# Altium schematic sheet CAT-PTT.SchDoc: TS50S USB CAT
size A4; DocumentNumber: 2; Revision: 1; SheetNumber: 2; SheetTotal: 4
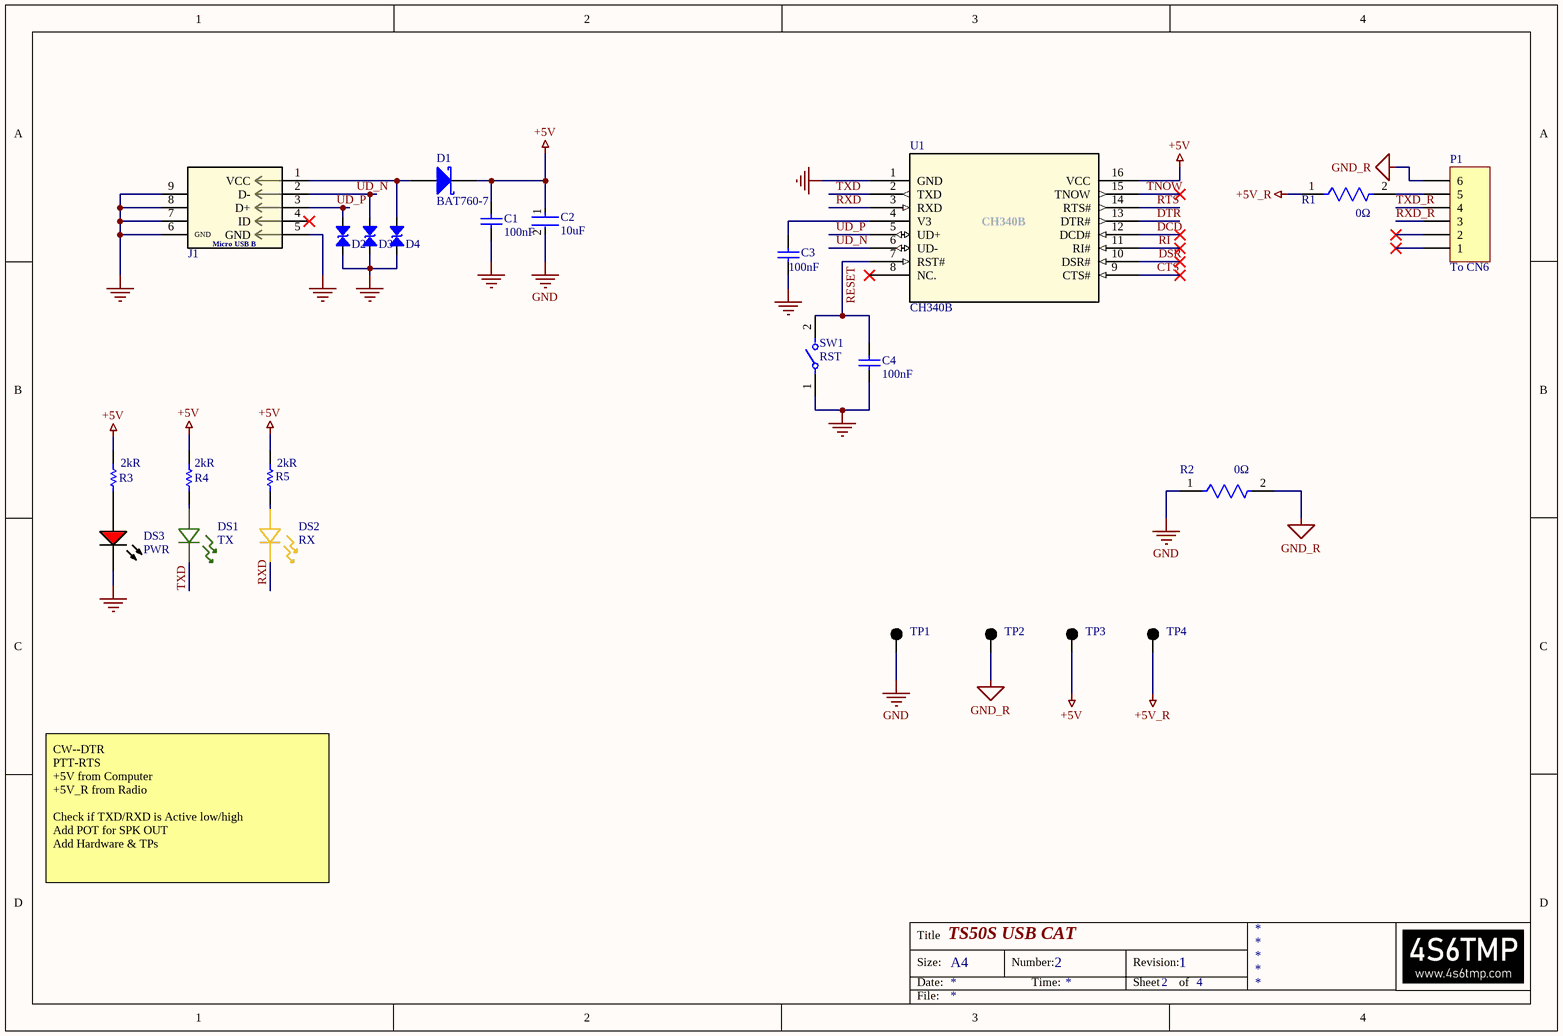
[diagram p0: CAT-PTT.SchDoc]

## Parts
C1  100nF  [CAPC1608X90X35ML10T15]
C2  10uF  [FP-GRM188-0_1-e0_2_0_55-IPC_A]
C3  100nF  [CAPC1608X90X35ML10T15]
C4  100nF  [CAPC1608X90X35ML10T15]
D1  BAT760-7  [SOD323_DIO]
D2  ESD Diode  [0603ESDA-05N]  (value not drawn)
D3  ESD Diode  [0603ESDA-05N]  (value not drawn)
D4  ESD Diode  [0603ESDA-05N]  (value not drawn)
DS1  TX  [LED_19-217/GHC-YR1S2/3T_EVE]
DS2  RX  [LED_19-217/GHC-YR1S2/3T_EVE]
DS3  PWR  [EVRL-0603-2_V]
J1  U254-051N-4BH806  [CONN_10103594-0001LF_AMP]  (value not drawn)
P1  To CN6  [HDR1X6]
R1  0Ω  [FP-RC0603-MFG]
R2  0Ω  [FP-RC0603-MFG]
R3  2kR  [RESC1608X55X25NL10T15]
R4  2kR  [RESC1608X55X25NL10T15]
R5  2kR  [RESC1608X55X25NL10T15]
SW1  RST  [FP-B3U-1000P-B-MFG]
TP1  GND  [KSTN-5001]  (value not drawn)
TP2  GND_R  [KSTN-5001]  (value not drawn)
TP3  +5V  [KSTN-5001]  (value not drawn)
TP4  +5V_R  [KSTN-5001]  (value not drawn)
U1  CH340B  [SOIC-16]

## Nets
+5V: C1.2 C2.1 D1.1(K) R3.2 R4.2 R5.2 TP3.1 U1.16(VCC)
+5V_R: R1.1 TP4.1
GND: C1.1 C2.2 C3.2 C4.1 D2.2 D3.2 D4.2 DS3.2(K) J1.5(GND) J1.6(GND) J1.7(GND) J1.8(GND) J1.9(GND) R2.1 SW1.1 TP1.1 U1.1(GND)
GND_R: P1.6 R2.2 TP2.1
CTS: U1.9(CTS#)
DCD: U1.12(DCD#)
DSR: U1.10(DSR#)
DTR: U1.13(DTR#)
RESET: C4.2 SW1.2 U1.7(RST#)
RI: U1.11(RI#)
RTS: U1.14(RTS#)
RXD: DS2.1 U1.3(RXD)
RXD_R: P1.3
TNOW: U1.15(TNOW)
TXD: DS1.1 U1.2(TXD)
TXD_R: P1.4
UD_N: D3.1 J1.2(D-) U1.6(UD-)
UD_P: D2.1 J1.3(D+) U1.5(UD+)
NetC3_1: C3.1 U1.4(V3)
NetD1_2: D1.2(A) D4.1 J1.1(VCC)
NetDS1_2: DS1.2 R4.1
NetDS2_2: DS2.2 R5.1
NetDS3_1: DS3.1(A) R3.1
NetP1_5: P1.5 R1.2

Not connected (* = marked no-connect by the designer): J1 4(ID)*; P1 1* 2*; U1 8(NC.)*

## Notes on the sheet
- CW--DTR
  PTT-RTS
  +5V from Computer
  +5V_R from Radio
  Check if TXD/RXD is Active low/high
  Add POT for SPK OUT
  Add Hardware & TPs
- Title
- Size:
- Date:
- A4
- Number:
- Time:
- Revision:
- Sheet
- of
- File:
- (in symbol U254-051N-4BH806) Micro USB B

## Library data of the parts
C1 C3 C4 = CMP-2006-02375-5: Chip Capacitor, 100 nF, +/- 10%, 50 V, -55 to 125 degC, 0603 (1608 Metric), RoHS, Tape and Reel; Manufacturer: Murata; Manufacturer Part Number: GCM188R71H104KA57D; Voltage Rating: 50 V; Dielectric: X7R; Voltage: 50V; Min Operating Temperature: -55 degC; ComponentLink1URL: http://www.murata.com/; PackageReference: 0603; Max Operating Temperature: 125 degC; ComponentLink1Description: Manufacturer URL; ComponentLink2Description: Datasheet; Packaging: Tape and Reel; PackageDescription: 2-Pin Surface Mount Device, Body 1.6 x 0.8 mm; Height: 0.8 mm; Mounting Technology: Surface Mount; Mount: Surface Mount; Length: 1.6 mm; ComponentLink2URL: http://psearch.en.murata.com/capacitor/product/GCM188R71H104KA57%23.pdf; Package Quantity: 4000; REACH SVHC: No SVHC; RoHSCompliant: true; DatasheetVersion: 07/2016; Supplier 1: Digi-Key; Supplier Part Number 1: 490-4779-1-ND; RoHS: Yes; Category: Ceramic Capacitors; Stock 1: 3146580; Pricing 1: 1=0.11000, 10=0.07900, 50=0.04300, 100=0.03510, 500=0.02510, 1000=0.01972 (USD); Case/Package: 0603; Case Code (Imperial): 0603; Case Code (Metric): 1608; Capacitance: 100nF; Tolerance: 10%; Termination: SMD/SMT; Voltage Rating (DC): 50V; Series: GCM; Construction: Flat; Width: 0.031inch; Thickness: 0.035inch; Depth: 0.8mm; Ratings: AEC-Q200; Radiation Hardening: No; Lead Free: Lead Free; RoHS Compliant: Yes; ComponentLink3URL: https://datasheet.ciiva.com/16624/product-16624562.pdf?src-supplier=Avnet+Europe; ComponentLink3Description: https://datasheet.ciiva.com/16624/product-16624562.pdf?src-supplier=Avnet+Europe; ComponentLink4URL: https://datasheet.ciiva.com/133/product-133574.pdf?src-supplier=Digi-Key; ComponentLink4Description: https://datasheet.ciiva.com/133/product-133574.pdf?src-supplier=Digi-Key; ComponentLink5URL: https://datasheet.ciiva.com/133/product-133575.pdf?src-supplier=Digi-Key; ComponentLink5Description: https://datasheet.ciiva.com/133/product-133575.pdf?src-supplier=Digi-Key; ComponentLink6URL: https://datasheet.ciiva.com/18183/getdatasheetpartid-98693-18183626.pdf?src-supplier=Verical; ComponentLink6Description: https://datasheet.ciiva.com/18183/getdatasheetpartid-98693-18183626.pdf?src-supplier=Verical; ComponentLink7URL: https://datasheet.ciiva.com/11786/0900766b80ef92d0-11786863.pdf?src-supplier=RSComponents; ComponentLink7Description: https://datasheet.ciiva.com/11786/0900766b80ef92d0-11786863.pdf?src-supplier=RSComponents; ComponentLink8URL: https://datasheet.ciiva.com/133/product-133573.pdf?src-supplier=Digi-Key; ComponentLink8Description: https://datasheet.ciiva.com/133/product-133573.pdf?src-supplier=Digi-Key; ComponentLink9URL: https://datasheet.ciiva.com/2989/product-2989242.pdf?src-supplier=Avnet; ComponentLink9Description: https://datasheet.ciiva.com/2989/product-2989242.pdf?src-supplier=Avnet; ComponentLink10URL: https://datasheet.ciiva.com/16497/product-16497247.pdf?src-supplier=Future+Electronics; ComponentLink10Description: https://datasheet.ciiva.com/16497/product-16497247.pdf?src-supplier=Future+Electronics
C2 = CMP-2006-02792-2: Chip Multilayer Ceramic Capacitors for General Purpose, 0603, 10uF, X5R, 15%, 20%, 6.3V; Packaging: Tape and Reel; Voltage Rating (DC): 6.3V; Width: 0.031inch; Termination: SMD/SMT; Dielectric: X5R; Package Quantity: 4000; Voltage Rating: 6.3V; Capacitance: 10uF; Case/Package: 0603; Min Operating Temperature: -55°C; Voltage: 6.3V; Length: 1.6mm; Thickness: 0.035inch; Lead Free: Lead Free; Depth: 0.8mm; Case Code (Imperial): 0603; Max Operating Temperature: 85°C; Material: Ceramic; Height: 0.8mm; Tolerance: 20%; Mount: Surface Mount; REACH SVHC: No SVHC; Radiation Hardening: No; Case Code (Metric): 1608
D1 = BAT760-7: 30V 1A 550mV @ 1A SOD-323 Schottky Barrier Diodes (SBD) RoHS; Supplier 1: Future Electronics; Supplier Part Number 1: 8129394; Manufacturer Product Number: BAT760-7; LCSC PN: C124187; Value: BAT760-7
D2-D4 = 0603ESDA-05N: Bidirectional - 50V - 5V 0603 ESD Protection Devices ROHS
DS1 = 19-217/GHC-YR1S2/3T: No Description Available; Vendor: Everlight Electronics; Built_By: EMA_Cory; SourceLibrary: Add_to_database_2021-02-25; Type: DEV; Colour: Green; Datasheet: https://media.digikey.com/pdf/Data%20Sheets/Everlight%20PDFs/19-217,GHC-YR1S2,3T.pdf; Manufacturer_Part_Number: 19-217/GHC-YR1S2/3T; Copyright: Copyright (C) 2018 Accelerated Designs. All rights reserved; RefDes: RefDes; Supplier 1: Digi-Key; Supplier Part Number 1: 19-217/GHC-YR1S2/3T-ND
DS2 = 19-217/Y5C-AP1Q2/3T: Yellow 590nm LED Indication - Discrete 2V 0603 (1608 Metric); Vendor: Everlight Electronics; SourceLibrary: Add_to_database_2021-02-25; Type: DEV; Manufacturer_Part_Number: 19-217/Y5C-AP1Q2/3T; RefDes: RefDes; Colour: Yellow; Supplier 1: Digi-Key; Supplier Part Number 1: 19-217/Y5C-AP1Q2/3T-ND
DS3 = CMP-2100-03578-1: Chip LED, Red, 5 V, 25 mA, -40 to 85 degC, 2-Pin SMD (0603), RoHS, Tape and Reel; Manufacturer: Everlight Electronics; Forward Voltage: 2.2V; Lens Style: Clear; Package Reference: 0603; Case/Package: 0603; RoHSCompliant: false; Package Description: 2-Pin Surface Mount Device, Body 1.6 x 0.8 mm; Colour: Red; Lead Free: LeadFree; Datasheet URL: https://datasheet.ciiva.com/4688/el-19-217-r6c-al1m2vy-3tpdf-187026-4688713.pdf; Manufacturer URL: http://www.everlight.com/; Datasheet Version: Rev. 1, 01/2005
J1 = U254-051N-4BH806: USB - Micro B Female USB 2 5 SMD USB Connectors RoHS; Vendor: XKB Connectivity; Datasheet: https://datasheet.lcsc.com/lcsc/2107141638_XKB-Connectivity-U254-051N-4BH806_C319170.pdf; Manufacturer_Part_Number: U254-051N-4BH806; RefDes: RefDes; Type: DEV
P1 = Header 6: Header, 6-Pin; LatestRevisionDate: 17-Jul-2002; LatestRevisionNote: Re-released for DXP Platform.; Publisher: Altium Limited
R1 = CMP-2000-06925-2: RES SMD 0 OHM JUMPER 1/10W 0603; Manufacturer: Yageo; Manufacturer Part Number: RC0603FR-070RL; Tolerance: 1%; Power Rating: 0.1W; Voltage Rating: 75V; Composition: Thick Film; Temperature Range Low: -55°C; Ipc Land Pattern Name: RESC16080X45; Lead Free: Yes; Digikey Description: RES SMD 0 OHM JUMPER 1/10W 0603; Height: 0.55mm; Automotive: No; Device Class L3: Chip SMD Resistors; Device Class L1: Passive Components; Device Class L2: Resistors; Footprint Url: http://www.yageo.com/exep/pages/download/literatures/PYu-R_Mount_10.pdf; Category: Res; Mouser Description: RC Series 0603 0.1 W 0 O Jumper Surface Mount Thick Film Chip Resistor; Value: 0Ω; Resistance: 0Ω; ComponentLink2URL: http://www.yageo.com/documents/recent/PYu-RC_Group_51_RoHS_L_10.pdf; Series: RC_L; ComponentLink2Description: Datasheet; RoHS: TRUE; Temperature: -55°C to +155°C; Temperature Range High: +155°C; Package: RC0603; Octopart: https://octopart.com/rc0603fr-070rl-yageo-1180803
R2 = CMP-2000-06925-2: DNP; Manufacturer: Yageo; Manufacturer Part Number: RC0603FR-070RL; Tolerance: 1%; Power Rating: 0.1W; Voltage Rating: 75V; Composition: Thick Film; Temperature Range Low: -55°C; Ipc Land Pattern Name: RESC16080X45; Lead Free: Yes; Digikey Description: RES SMD 0 OHM JUMPER 1/10W 0603; Height: 0.55mm; Automotive: No; Device Class L3: Chip SMD Resistors; Device Class L1: Passive Components; Device Class L2: Resistors; Footprint Url: http://www.yageo.com/exep/pages/download/literatures/PYu-R_Mount_10.pdf; Category: Res; Mouser Description: RC Series 0603 0.1 W 0 O Jumper Surface Mount Thick Film Chip Resistor; Value: 0Ω; Resistance: 0Ω; ComponentLink2URL: http://www.yageo.com/documents/recent/PYu-RC_Group_51_RoHS_L_10.pdf; Series: RC_L; ComponentLink2Description: Datasheet; RoHS: TRUE; Temperature: -55°C to +155°C; Temperature Range High: +155°C; Package: RC0603; Octopart: https://octopart.com/rc0603fr-070rl-yageo-1180803
R3-R5 = CMP-2000-04259-1: Part Number: RC0603JR-072KL; Manufacturer: Yageo; Tolerance: 5%; Temperature Coefficient: 100ppm/°C; Voltage Rating (DC): 50V; Power Rating: 100mW; Supplier 1: Digi-Key; Supplier Part Number 1: 311-2.0KGRCT-ND; Manufacturer Part Number: RC0603JR-072KL; RoHS: Yes; Category: Chip SMD Resistors; Stock 1: 288847; Pricing 1: 1=0.10000, 10=0.02000, 100=0.00800, 1000=0.00360, 2500=0.00312 (USD); Case/Package: 0603; Number of Pins: 2; Case Code (Imperial): 0603; Case Code (Metric): 1608; Size Code: 0603; Min Operating Temperature: -55°C; Max Operating Temperature: 155°C; Resistance: 2kR; Resistor Type: Thick Film; Packaging: Tape and Reel; Voltage Rating: 50V; Termination: SMD/SMT; Features: Moisture Resistant; Series: RC; Max Power Dissipation: 100mW; Number of Terminations: 2; Resistance Tolerance: 5%; Construction: Rectangular; Length: 1.6mm; Depth: 0.8mm; Lead Free: Lead Free; REACH SVHC: No SVHC; Military Standard: Not; RoHS Compliant: Yes; ComponentLink1URL: https://datasheet.ciiva.com/46395/443971-46395143.pdf?src-supplier=Element14; ComponentLink1Description: https://datasheet.ciiva.com/46395/443971-46395143.pdf?src-supplier=Element14
SW1 = CMP-08834-000005-1: SWITCH TACTILE SPST-NO 0.05A 12V; Manufacturer Part Number: B3U-1000P-B; Manufacturer: Omron; Operating Force: 1.5N; Contact Current Rating: 50mA; Contact Resistance: 100mΩ; Electromechanical Life: 200000Cycles; Height: 1.75mm; Device Class L2: Switches; Temperature Range High: +70°C; Digikey Description: SWITCH TACTILE SPST-NO 0.05A 12V; Throw Configuration: SPST-NO; Ambient Temperature Range High: +70°C; Temperature: -25°C to +70°C; Lead Free: Yes; ComponentLink2URL: https://omronfs.omron.com/en_US/ecb/products/pdf/en-b3u.pdf; Device Class L3: Tactile Switches; Ambient Temperature Range Low: -25°C; Mount: Surface Mount; Automotive: No; Mouser Description: Tactile Switches Top Actuated with boss w/o ground; Octopart: https://octopart.com/b3u-1000p-b-omron-1057356; RoHS: TRUE; Package: 0; Device Class L1: Electromechanical; Voltage Rating Dc: 12V; Category: Switch; Temperature Range Low: -25°C; ComponentLink2Description: Datasheet
TP1-TP4 = CMP-2000-05181-1: Test Point, Black, 1-Pin THD, RoHS, Bulk; Manufacturer: Keystone; Other Names: 5001K; Catalog Drawings: 5000Series; Alternate Color: 5004K-ND / -TESTPOINTPCMINI.040"DYELLOW / 5003K-ND / -TESTPOINTPCMINI.040"DORANGE / 5002K-ND / -TESTPOINTPCMINI.040"DWHITE / 5000K-ND / -TESTPOINTPCMINI.040"DRED; Kits: DKTGRS232C-KIT-ND / -TTLCONVERTER; Online Catalog: ColorCodedTestPoints; Datasheet URL: https://ciiva.com/datasheet-click-2917627?src=ciiva&sig=bd195616; Mounting Type: 0.040"(1.02mm)HoleDiameter; Family: TestPoints; RoHS Information: RoHSComplianceStatement; Datasheet Version: Rev. G, 12/2008; Color: Black; Category: TestandMeasurement; Standard Package: 100; Manufacturer URL: http://www.keyelco.com/; Material: Base,Nylon46,UL94V-0; Type: PCTestPoint,Miniature; Terminal: 0.010"x0.020"(0.25mmx0.51mm)PhosphorBronzeWire,SilverPlated; Series: THM; Packaging: Bulk
U1 = CH340B: Transceiver USB 2.0 2Mbps SOP-16_150mil USB ICs RoHS; Vendor: WCH; Datasheet: https://datasheet.lcsc.com/lcsc/2107141453_WCH-Jiangsu-Qin-Heng-CH340B_C81010.pdf; Manufacturer_Part_Number: CH340B; RefDes: RefDes; Type: DEV; ComponentLink1Description: LCSC; ComponentLink1URL: https://lcsc.com/product-detail/USB-ICs_WCH-Jiangsu-Qin-Heng-CH340B_C81010.html